# Altium schematic sheet Controller.SchDoc: Controller-Section
size B
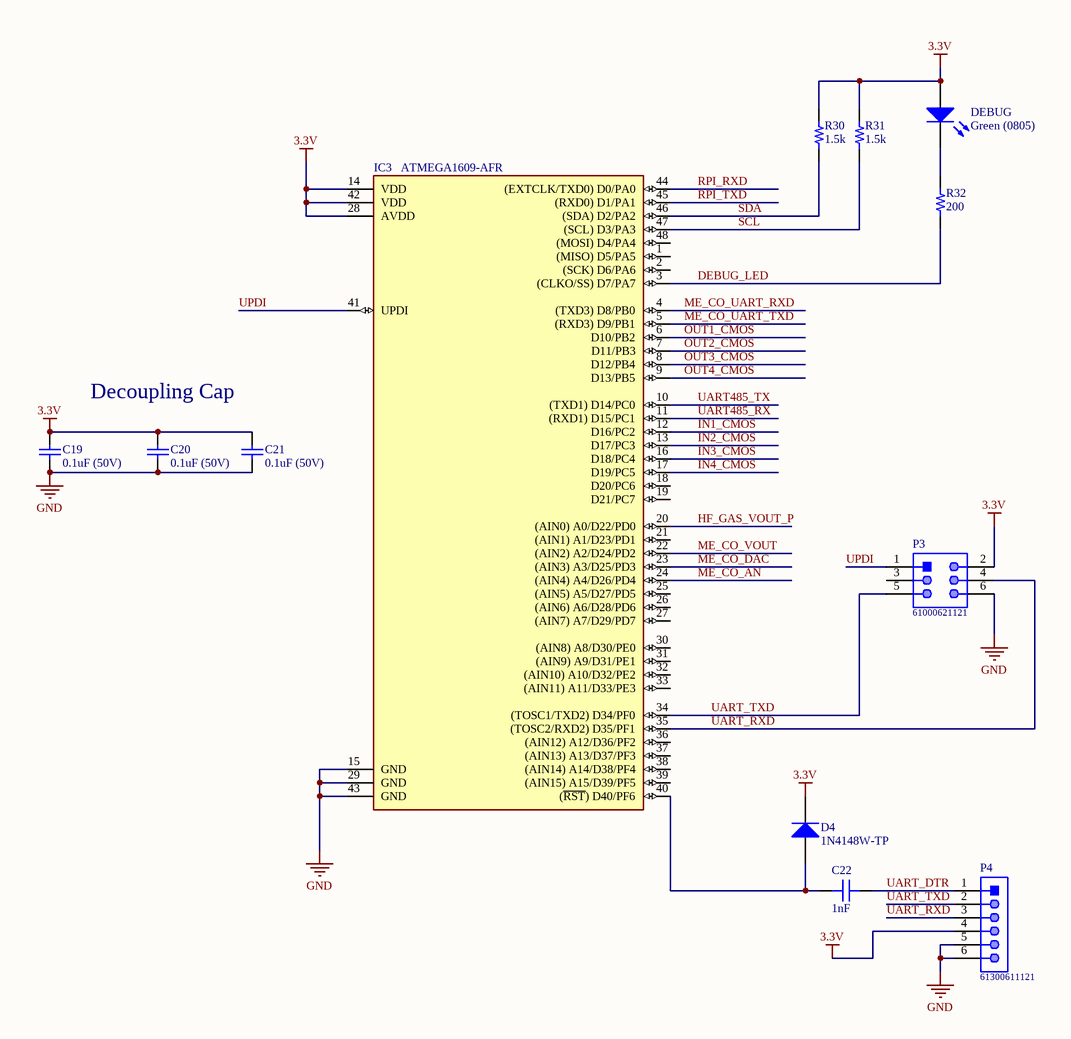
[diagram p0: Controller.SchDoc]

## Parts
C19  0.1uF (50V)  [CAPC1608X95X40NL15T15]
C20  0.1uF (50V)  [CAPC1608X95X40NL15T15]
C21  0.1uF (50V)  [CAPC1608X95X40NL15T15]
C22  1nF  [CAP 0603_1608]
D4  1N4148W-TP  [MCC-SOD123_V]
DEBUG  Green (0805)  [0805_A]
IC3  ATMEGA1609-AFR  [QFP50P900X900X120-48N]
P3  61000621121  [61000621121]
P4  61300611121  [61300611121]
R30  1.5k  [RES 0603_1608]
R31  1.5k  [RES 0603_1608]
R32  200  [RES 0603_1608]

## Nets
3.3V: C19.2 C20.2 C21.2 D4.2(K) DEBUG.2(A) IC3.14(VDD) IC3.28(AVDD) IC3.42(VDD) P3.2 P4.4 R30.1 R31.1
GND: C19.1 C20.1 C21.1 IC3.15(GND) IC3.29(GND) IC3.43(GND) P3.6 P4.5 P4.6
DEBUG_LED: IC3.3((CLKO/SS)_D7/PA7) R32.1
HF_GAS_VOUT_P: IC3.20((AIN0)_A0/D22/PD0)
IN1_CMOS: IC3.12(D16/PC2)
IN2_CMOS: IC3.13(D17/PC3)
IN3_CMOS: IC3.16(D18/PC4)
IN4_CMOS: IC3.17(D19/PC5)
ME_CO_AN: IC3.24((AIN4)_A4/D26/PD4)
ME_CO_DAC: IC3.23((AIN3)_A3/D25/PD3)
ME_CO_UART_RXD: IC3.4((TXD3)_D8/PB0)
ME_CO_UART_TXD: IC3.5((RXD3)_D9/PB1)
ME_CO_VOUT: IC3.22((AIN2)_A2/D24/PD2)
OUT1_CMOS: IC3.6(D10/PB2)
OUT2_CMOS: IC3.7(D11/PB3)
OUT3_CMOS: IC3.8(D12/PB4)
OUT4_CMOS: IC3.9(D13/PB5)
RPI_RXD: IC3.44((EXTCLK/TXD0)_D0/PA0)
RPI_TXD: IC3.45((RXD0)_D1/PA1)
SCL: IC3.47((SCL)_D3/PA3) R31.2
SDA: IC3.46((SDA)_D2/PA2) R30.2
UART485_RX: IC3.11((RXD1)_D15/PC1)
UART485_TX: IC3.10((TXD1)_D14/PC0)
UART_DTR: C22.1 P4.1
UART_RXD: IC3.35((TOSC2/RXD2)_D35/PF1) P3.4 P4.3
UART_TXD: IC3.34((TOSC1/TXD2)_D34/PF0) P3.5 P4.2
UPDI: IC3.41(UPDI) P3.1
NetC22_2: C22.2 D4.1(A) IC3.40((~{RST})_D40/PF6)
NetDEBUG_1: DEBUG.1(K) R32.2

Not connected (* = marked no-connect by the designer): IC3 1((MISO)_D5/PA5) 2((SCK)_D6/PA6) 18(D20/PC6) 19(D21/PC7) 21((AIN1)_A1/D23/PD1) 25((AIN5)_A5/D27/PD5) 26((AIN6)_A6/D28/PD6) 27((AIN7)_A7/D29/PD7) 30((AIN8)_A8/D30/PE0) 31((AIN9)_A9/D31/PE1) 32((AIN10)_A10/D32/PE2) 33((AIN11)_A11/D33/PE3) 36((AIN12)_A12/D36/PF2) 37((AIN13)_A13/D37/PF3) 38((AIN14)_A14/D38/PF4) 39((AIN15)_A15/D39/PF5) 48((MOSI)_D4/PA4); P3 3

## Notes on the sheet
- Decoupling Cap
- Title
- Size:
- Date:
- B
- Number:
- Time:
- Revision:
- Sheet
- of
- Maptix Co.,Ltd
- 99/193 Atoll Bali Beach
- Khlong Luang Phaeng
- Chacheongsao
- Thailand 24000
- File:

## Library data of the parts
C19-C21 = CMP-2006-00072-1: Part Number: VJ0603Y332JXACW1BC; Manufacturer: Vitramon
C22 = VJ0603Y332JXACW1BC: CAP CERAMIC 50V X7R 0603; Manufacturer: Vishay Vitramon; Capacitance: 3300pF; Tolerance: ±5%; Part Number: VJ0603Y332JXACW1BC; Value: 1nF; Applications: General Purpose; ComponentLink1Description: Datasheet; ComponentLink1URL: https://www.vishay.com/docs/28548/vjw1bcbascomseries.pdf; ComponentLink2Description: DigiKey Link; ComponentLink2URL: http://digikey.com/product-detail/en/vishay-vitramon/VJ0603Y332JXACW1BC/720-VJ0603Y332JXACW1BCCT-ND/11198425; Device Package: 0603 (1608 Metric); LastUpdated: 1/2/2020 12:01:35 AM; Lifecycle Status: Active; Minimum Order: 1; Mounting Type: Surface Mount, MLCC; Operating Temperature: -55°C ~ 125°C; Package / Case: 0603 (1608 Metric); Packaging: Unknown; PartId: 26247; Part Status: Active; Price: 0.00; Series: VJ; Size / Dimension: 0.063" L x 0.031" W (1.60mm x 0.80mm); Supplier 1: DigiKey; Supplier Part Number 1: 720-VJ0603Y332JXACW1BCCT-ND; Temperature Coefficient: X7R; Thickness (Max): 0.034" (0.87mm); Voltage - Rated: 50V
D4 = CMP-2000-04993-1: High Speed Switching Diode, 400 mW, 150 mA, -65 to 150 degC, 2-Pin SOD123, RoHS, Tape and Reel; Manufacturer: Micro Commercial Components; Reverse Recovery Time-Max: 4ns; Average Forward Current-Max: 0.15A; Peak Current-Max: 2A; Power Dissipation: 400mW; Reverse Voltage-Max [Vrrm]: 100V; Datasheet URL: https://datasheet.ciiva.com/16836/1n4148wsod123-16836277.pdf; Package Reference: SOD123; Package URL: http://www.mccsemi.com/up_pdf/1N4448W(SOD-123).pdf; Package Description: 2-Pin Small Outline Diode, Body 2.7 x 1.6 mm, Height 1.35 mm; Manufacturer URL: http://www.mccsemi.com/; Datasheet Version: Rev. C, 07/2014
DEBUG = CMP-1426-00007-1: SMD mono-color Chip LED, WL-SMCW, Green; PartNumber: 150080GS75000; Manufacturer: Wuerth Elektronik; PackageReference: 0805_A; Color: Green; ComponentLink2URL: http://katalog.we-online.com/led/datasheet/150080GS75000.pdf; ComponentLink1URL: http://www.we-online.com; ComponentLink1Description: Manufacturer URL; ComponentLink2Description: Datasheet
IC3 = ATMEGA1609-AFR: Integrated Circuit; Manufacturer_Name: Microchip; Datasheet Link: https://componentsearchengine.com/Datasheets/1/ATMEGA1609-AFR.pdf; Height: 1.2mm; Manufacturer_Part_Number: ATMEGA1609-AFR; Mouser Part Number: 579-ATMEGA1609-AFR; Mouser Price/Stock: https://www.mouser.com/Search/Refine.aspx?Keyword=579-ATMEGA1609-AFR
P3 = CMP-1502-01024-1: SMT Vertical Pin Header WR-PHD, Pitch 2.54 mm, Dual Row, 6 pins; Manufacturer: Wurth Elektronik; Withstanding Voltage: 500VAC; Contact Resistance: 20mOhm; Working Voltage: 250VAC; Gender: Male; Rated Current: 3A; Pin Number: 6; Pitch: 2.54mm; Part Number: 61000621121; Operating Temperature: -40to125degC; Mounting Technology: SMT; Packaging: Tube; Datasheet URL: https://katalog.we-online.de/em/datasheet/6100xx21121.pdf; Package Reference: 61000621121; Publisher: WurthElektronik; Row Number: Dual; Orientation: Vertical; Manufacturer URL: http://www.we-online.de
P4 = CMP-1502-01070-1: THT Vertical Pin Header WR-PHD, Pitch 2.54 mm, Single Row, 6 pins; Manufacturer: Wurth Elektronik; Gender: Male; Pin Number: 6; Pitch: 2.54mm; Working Voltage: 250VAC; Rated Current: 3A; Withstanding Voltage: 500VAC; Contact Resistance: 20mOhm; Operating Temperature: -40to105degC; Packaging: Bag; Datasheet URL: https://katalog.we-online.de/em/datasheet/6130xx11121.pdf; Package Reference: 61300611121; Mounting Technology: THT; Publisher: WurthElektronik; Part Number: 61300611121; Manufacturer URL: http://www.we-online.de; Row Number: Single; Orientation: Vertical
R30-R32 = CRCW060329K4FKEA: Resistor; Manufacturer: Vishay Dale; Power (Watts): 0.1W, 1/10W; Resistance: 29.4 kOhms; Temperature Coefficient: ±100ppm/°C; Tolerance: ±1%; Part Number: CRCW060329K4FKEA; ComponentLink1Description: Datasheet; ComponentLink1URL: http://www.vishay.com/docs/20035/dcrcwe3.pdf; ComponentLink2Description: DigiKey Link; ComponentLink2URL: http://digikey.com/product-detail/en/vishay-dale/CRCW060329K4FKEA/541-29.4KHCT-ND/1179975; Composition: Thick Film; Device Package: 0603 (1608 Metric); Features: Automotive AEC-Q200; Height - Seated (Max): 0.020" (0.50mm); LastUpdated: 1/2/2020 12:06:58 AM; Lifecycle Status: Active; Minimum Order: 1; Number of Terminations: 2; Operating Temperature: -55°C ~ 155°C; Package / Case: 0603 (1608 Metric); Packaging: TapeAndReel; PartId: 7975; Part Status: Active; Price: 0.00; Ratings: AEC-Q200; Series: CRCW; Size / Dimension: 0.061" L x 0.033" W (1.55mm x 0.85mm); Supplier 1: DigiKey; Supplier Part Number 1: 541-29.4KHCT-ND; Supplier Device Package: 0603
  R30 R31: Value: 1.5k
  R32: Value: 200